# EAGLE design Klon (EAGLE 9.2.2)
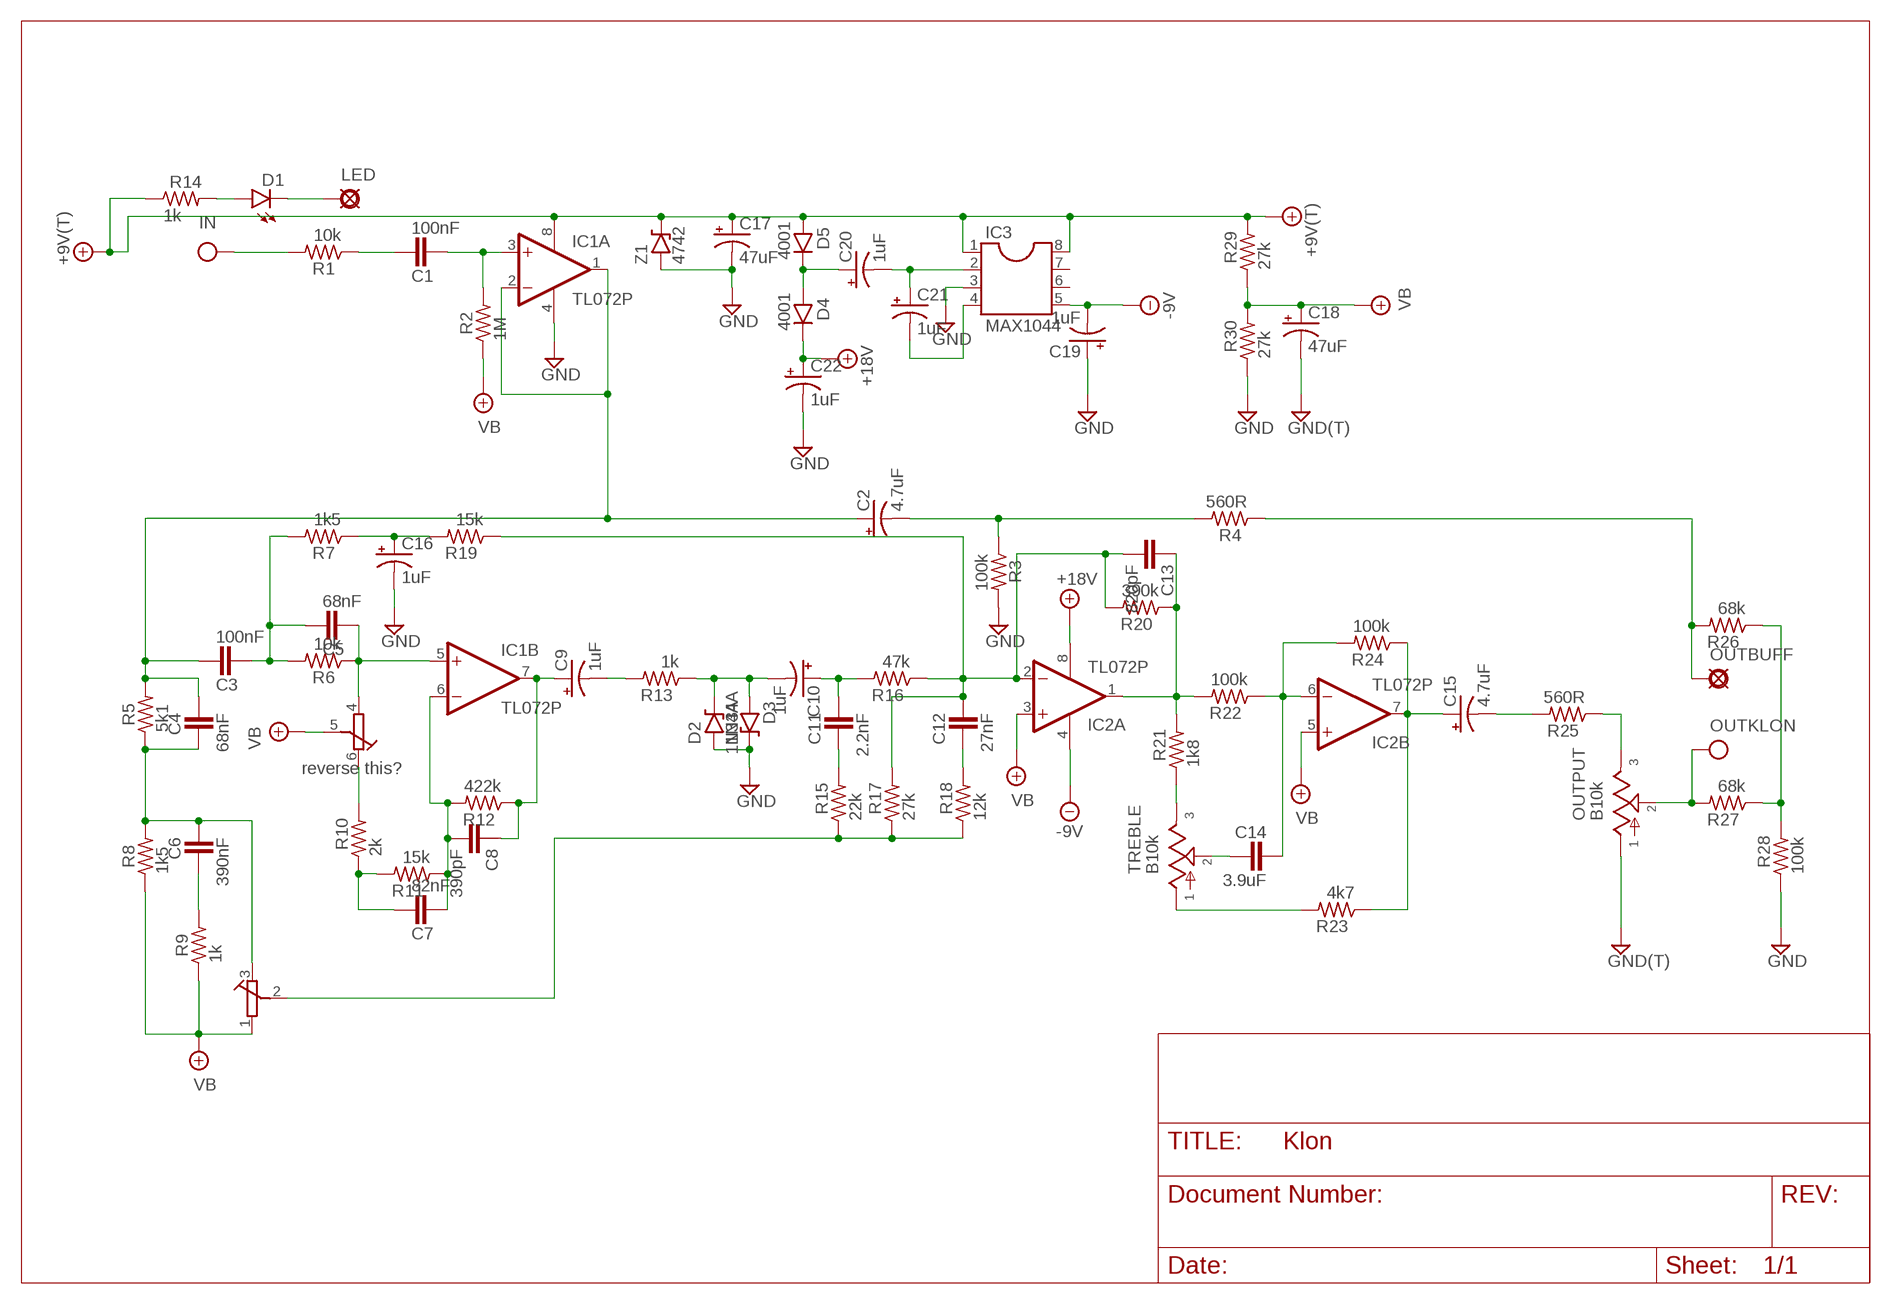
[diagram p0: schematic, sheet 1]

## Parts
+9V  +9V(T)  [SQUARE]
+9V1  +9V(T)  [SQUARE]
C1  100nF  072X0252  [072X025]
C2  4.7uF  0501  [050_020_1]
C3  100nF  072X0252  [072X025]
C4  68nF  072X0252  [072X025]
C5  68nF  072X0252  [072X025]
C6  390nF  072X0252  [072X025]
C7  82nF  072X0252  [072X025]
C8  390pF  050X030_0251  [050X030_025]
C9  1uF  0501  [050_020_1]
C10  1uF  0501  [050_020_1]
C11  2.2nF  072X0252  [072X025]
C12  27nF  072X0252  [072X025]
C13  820pF  050X030_0251  [050X030_025]
C14  3.9uF  072X0252  [072X025]
C15  4.7uF  0501  [050_020_1]
C16  1uF  0501  [050_020_1]
C17  47uF  0631  [063_025]
C18  47uF  0631  [063_025]
C19  1uF  0501  [050_020_1]
C20  1uF  0501  [050_020_1]
C21  1uF  0501  [050_020_1]
C22  1uF  0501  [050_020_1]
D1  LED  LED3MM  [LED3MM]
D2  1N34A  1N9ZENER  [DO35-3]
D3  1N34A  1N9ZENER  [DO35-3]
D4  4001  1N400X.3  [DO41-3]
D5  4001  1N400X.3  [DO41-3]
G  GND(T)  [SQUARE]
G1  GND(T)  [SQUARE]
GAIN  B100k  ALPHA16MM  [ALPHA16MM]
IC1  TL072P  [DIL08]
IC2  TL072P  [DIL08]
IC3  MAX1044  [DIL08]
IN  IN(T)  [SQUARE]
LED  PAD  [SQUARE]
OUTBUFF  PAD  [SQUARE]
OUTKLON  OUT(T)  [SQUARE]
OUTPUT  B10k  POT16MM  [16MM]
R1  10k  6MM.3  [R0207/3]
R2  1M  6MM.3  [R0207/3]
R3  100k  6MM.3  [R0207/3]
R4  560R  6MM.3  [R0207/3]
R5  5k1  6MM.3  [R0207/3]
R6  10k  6MM.3  [R0207/3]
R7  1k5  6MM.3  [R0207/3]
R8  1k5  6MM.3  [R0207/3]
R9  1k  6MM.3  [R0207/3]
R10  2k  6MM.3  [R0207/3]
R11  15k  6MM.3  [R0207/3]
R12  422k  6MM.3  [R0207/3]
R13  1k  6MM.3  [R0207/3]
R14  1k  6MM.3  [R0207/3]
R15  22k  6MM.3  [R0207/3]
R16  47k  6MM.3  [R0207/3]
R17  27k  6MM.3  [R0207/3]
R18  12k  6MM.3  [R0207/3]
R19  15k  6MM.3  [R0207/3]
R20  390k  6MM.3  [R0207/3]
R21  1k8  6MM.3  [R0207/3]
R22  100k  6MM.3  [R0207/3]
R23  4k7  6MM.3  [R0207/3]
R24  100k  6MM.3  [R0207/3]
R25  560R  6MM.3  [R0207/3]
R26  68k  6MM.3  [R0207/3]
R27  68k  6MM.3  [R0207/3]
R28  100k  6MM.3  [R0207/3]
R29  27k  6MM.3  [R0207/3]
R30  27k  6MM.3  [R0207/3]
TREBLE  B10k  POT16MM  [16MM]
Z1  4742  1N47XX3  [DO41-3]

## Nets
+9V: +9V1.1(+9V) +9V.1(+9V) C17.+ D5.A IC1.8(P:V+) IC3.1 IC3.8 R14.1 R29.2 Z1.C
+18V: C22.+ D4.C IC2.8(P:V+)
-9V: C19.- IC2.4(P:V-) IC3.5
GND: C16.- C17.- C18.- C19.+ C22.- D2.A D3.C G1.1(GND) G.1(GND) IC1.4(P:V-) IC3.3 OUTPUT.1 R3.2 R28.1 R30.1 Z1.A
IN: IN.1(IN) R1.2
N$1: C2.- R3.1 R4.2
N$2: D1.K(C) LED.1(PAD)
N$3: D1.A R14.2
N$4: C20.+ D4.A D5.C
N$5: C2.+ C3.2 C4.2 IC1.1(A:OUT) IC1.2(A:-IN) R5.2
N$6: C21.- IC3.4
N$7: C13.1 IC2.1(A:OUT) R20.1 R21.2 R22.2
N$8: C6.1 R9.2
N$9: OUTBUFF.1(PAD) R4.1 R26.2
N$10: C1.2 R1.1
N$11: C1.1 IC1.3(A:+IN) R2.2
N$12: C4.1 C6.2 GAIN.3(IN) R5.1 R8.2
N$13: C9.- R13.2
N$14: C3.1 C5.2 R6.2 R7.2
N$15: C16.+ R7.1 R19.2
N$16: C5.1 GAIN.4(GND) IC1.5(B:+IN) R6.1
N$17: GAIN.6(IN) R10.2
N$18: C7.2 R10.1 R11.2
N$19: C7.1 C8.2 IC1.6(B:-IN) R11.1 R12.2
N$20: C8.1 C9.+ IC1.7(B:OUT) R12.1
N$21: C10.- D2.C D3.A R13.1
N$22: R21.1 TREBLE.3
N$23: C10.+ C11.2 R16.2
N$24: C11.1 R15.2
N$25: C12.2 C13.2 IC2.2(A:-IN) R16.1 R17.2 R19.1 R20.2
N$26: GAIN.2(OUT) R15.1 R17.1 R18.1
N$27: C12.1 R18.2
N$28: C14.1 TREBLE.2
N$29: C14.2 IC2.6(B:-IN) R22.1 R24.2
N$30: R23.2 TREBLE.1
N$31: C15.+ IC2.7(B:OUT) R23.1 R24.1
N$32: C15.- R25.2
N$33: OUTPUT.3 R25.1
N$34: C20.- C21.+ IC3.2
N$35: R26.1 R27.1 R28.2
OUT: OUTKLON.1(OUT) OUTPUT.2 R27.2
VB: C18.+ GAIN.1(GND) GAIN.5(OUT) IC2.3(A:+IN) IC2.5(B:+IN) R2.1 R8.1 R9.1 R29.1 R30.2
Unconnected: IC3.6 IC3.7

## Notes on the sheet
- reverse this?

## Library data of the parts
+9V +9V1 = mb_supply:+9V(T): +9V Voltage Supply use this to hook up +9v throughout a schematic instead of running wire automatically labels the net "+9v" adds a hookup pad to the circuit board
C1 C3-C7 C11 C12 C14 = mb_caps-box:072X025: 1000pF - 0.47uF WIMA MKP2 63, 100V: 1000pF - 0.015uF; MKS2 50V: 0.33 - 0.47uF; 63V: 1000pF - 0.22uF;
C2 C9 C10 C15 C16 C19-C22 = mb_caps-electro:050: 0.22 - 100uF Xicon values at Mouser.com: 10V: 10 - 100uF; 16V: 2.2 - 47uF; 25V: 0.47 - 47uF; 50V: 0.22 - 22uF
C8 C13 = mb_caps-ceramic:050X030_025: 47 - 120pF Xicon Ceramic Disc 2.5mm lead spacing
C17 C18 = mb_caps-electro:063: 33 - 220uF Xicon values at Mouser.com 10V: 220uF; 16V: 100uF; 25V: 100uF; 50V: 33uF
D1 = mb_diodes:LED
D2 D3 = mb_diodes:1N9*ZENER: 1N9???B Zener Diode DO-35 case 1N957B - 1N992B (6.8V to 200V)
D4 D5 = mb_diodes:1N400X: Rectifier Diodes often used in power supply to prevent damage from reverse polarization
G G1 = mb_supply:GND(T): Ground use this to hook up ground (GND) throughout a schematic instead of running wire automatically labels the net "GND" adds a hookup pad to the circuit board (you can use several)
GAIN = Pots - custom:ALPHA16MM
IC1 IC2 = mb_ics:TL072: OP AMP
IC3 = mb_ics:MAX1044
IN = mb_supply:IN(T): Input obsolete: use Pad instead and label net shematic input label with circuit board terminal/pad generally used only once on a schematic (because this device labels the net "IN" in the same way as a voltage supply or ground net)
LED OUTBUFF = mb_supply:PAD: PAD use this package for pads with any purpose, including input, output, send or return various pad shapes: round, square, octogonal, long, and long offset
OUTKLON = mb_supply:OUT(T): Output obsolete: use Pad instead and label net output label with circuit board terminal/pad usually appears only once on a schematic
OUTPUT TREBLE = mb_pots:POT: Potentiometers the arrow indicates the clockwise motion of th wiper (lug 2) fully counter clockwise there is no resistance between lugs 1 and 2 fully clockwise the resistance between lugs 1 and 2 is the value of the pot
R1-R30 = mb_resistors:6MM: 6mm Resistors Leads spaced 1-6 holes apart for 0.1" perfboard. Suitable for 1/4 watt resistors.
Z1 = mb_diodes:1N47XX: Zener Diode 1N4728 - 1N4764: 3.3 V - 100V, 10% (1n47xxA 5%); DO-41 glass case

## Board
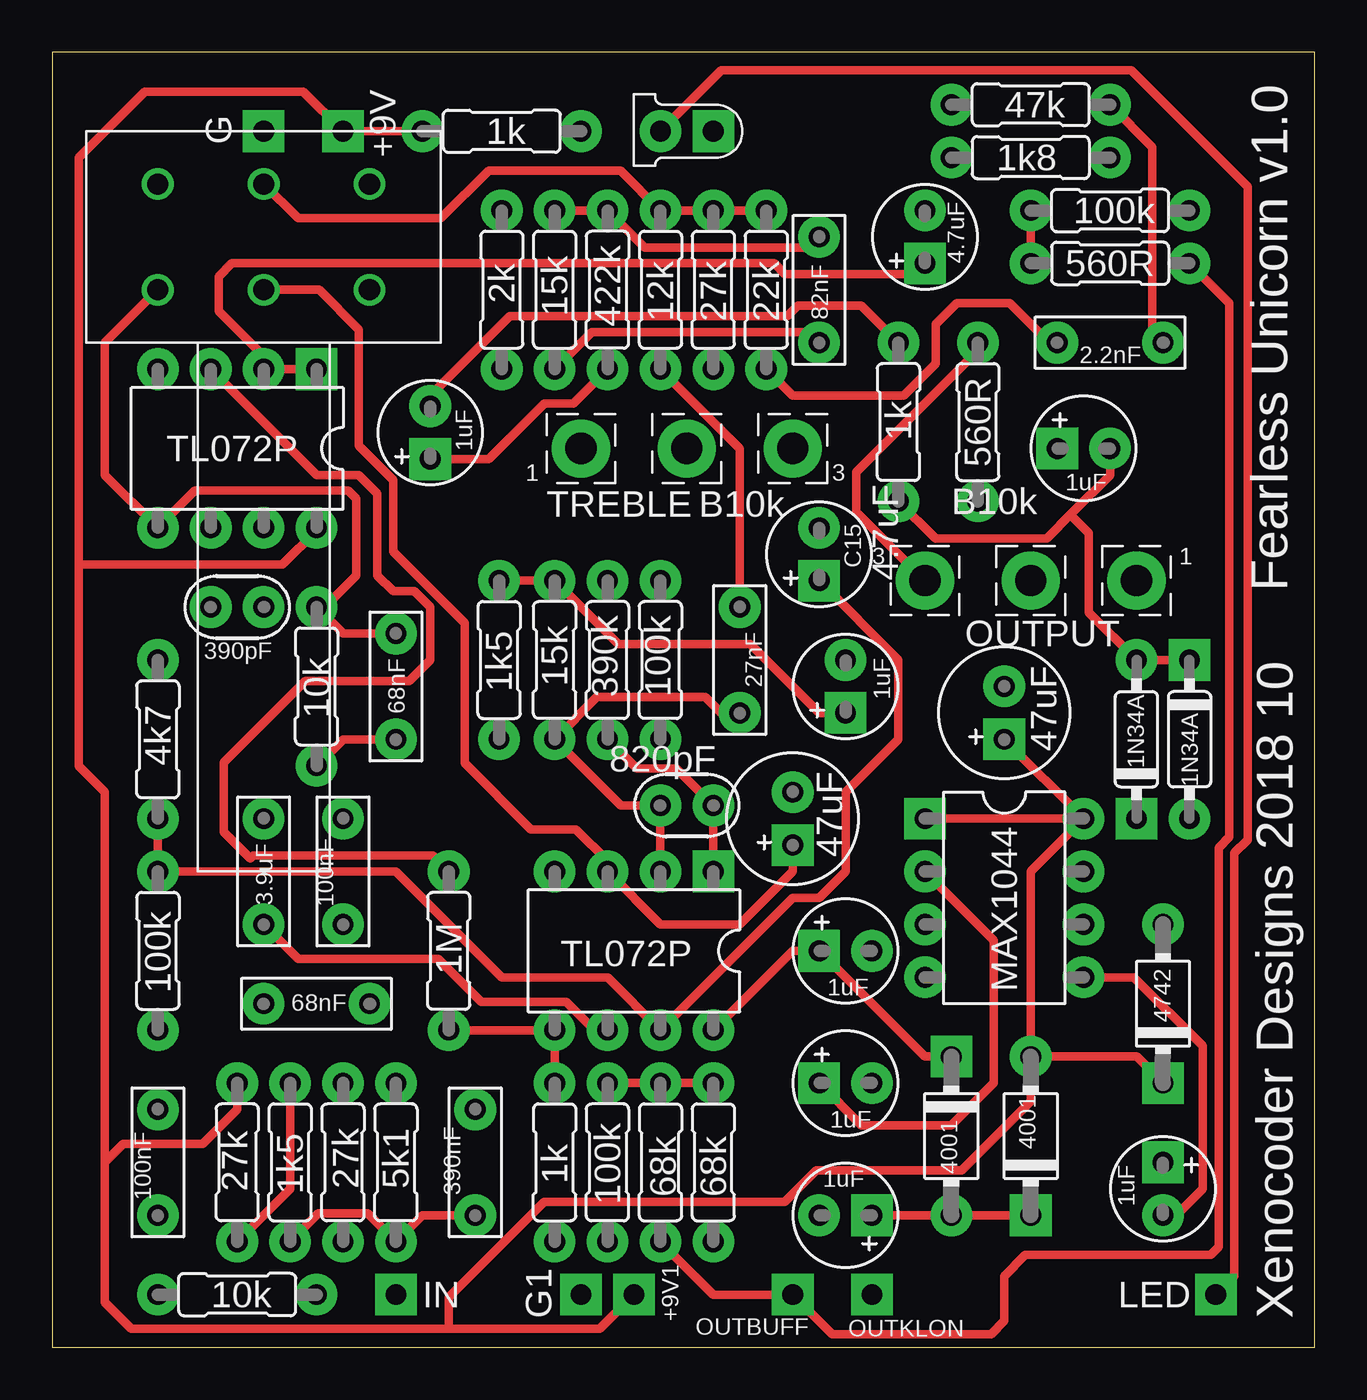
[diagram p1: board, top side]
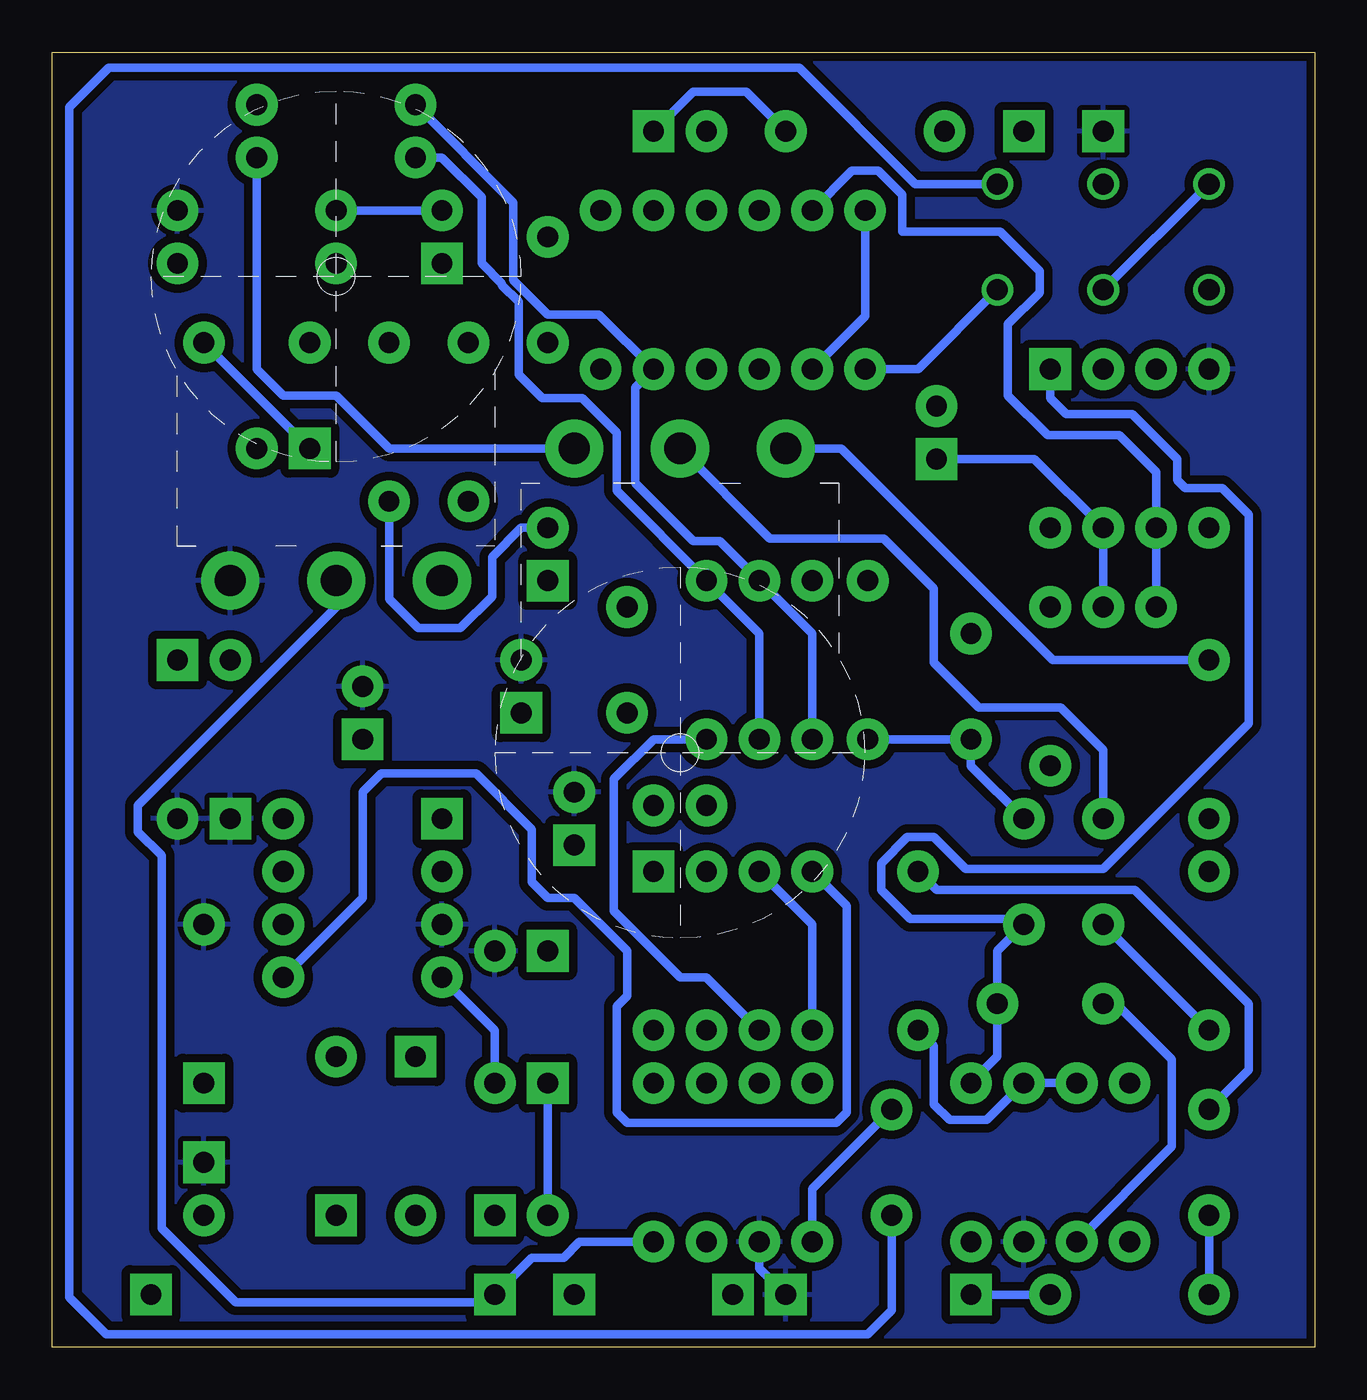
[diagram p2: board, bottom side, seen from below]

Size 60.63 x 62.22 mm. Coordinates in mm from the lower left corner, seen from the top.
Outline: 0,0 60.63,0 60.63,62.22 0,62.22 0,0
Copper layers (1*16): Top 0.035559375mm / dielectric 1.6mm / Bottom 0.035559375mm
Design rules "oshpark-2layer": minimum track width 6mil, minimum drill 10mil, track to track 6mil, track to pad 6mil, pad to pad 6mil, via to via 6mil, smd to smd 6mil, copper to edge 15mil, drill to drill 6mil, minimum pad ring 5mil, minimum via ring 5mil, stop-mask expansion 2.5mil, vias tented up to drill 0mil, thermal gap 10mil

### Footprints (pad centres in the part's own frame; a part is rotated, then mirrored left to right if it is on the bottom)
SQUARE = drill 1 pad 2 square: 1 0,0
072X025 = drill 1 pad 2: 1 -2.54,0; 2 2.54,0
050_020_1 = drill 1 pad 2 square: + -1.27,0 | drill 1 pad 2: - 1.27,0
050X030_025 = drill 1 pad 2: 1 -1.27,0; 2 1.27,0
063_025 = drill 1 pad 2 square: + -1.27,0 | drill 1 pad 2: - 1.27,0
LED3MM = drill 1 pad 2 square: A -1.27,0 | drill 1 pad 2: K 1.27,0
DO35-3 = drill 1 pad 2: A 3.81,0 | drill 1 pad 2 square: C -3.81,0
DO41-3 = drill 1 pad 2: A 3.81,0 | drill 1 pad 2 square: C -3.81,0
ALPHA16MM = drill 1.016: 1 -5.08,2.54; 2 0,2.54; 3 5.08,2.54; 4 -5.08,-2.54; 5 0,-2.54; 6 5.08,-2.54
DIL08 = drill 1 pad 2 square: 1 -3.81,-3.81 | drill 1 pad 2: 2 -1.27,-3.81; 3 1.27,-3.81; 4 3.81,-3.81; 5 3.81,3.81; 6 1.27,3.81; 7 -1.27,3.81; 8 -3.81,3.81
16MM = drill 1.5 pad 2.794: 1 5.08,0; 2 0,0; 3 -5.08,0
R0207/3 = drill 1 pad 2: 1 -3.81,0; 2 3.81,0

### Placement (x,y rotation side)
+9V  13.97,58.42 0 top
+9V1  27.94,2.54 0 top
C1  5.08,8.89 270 top
C2  41.91,53.34 90 top
C3  13.97,22.86 270 top
C4  12.7,16.51 0 top
C5  16.51,31.75 270 top
C6  20.32,8.89 270 top
C7  36.83,50.8 270 top
C8  8.89,35.56 180 top
C9  18.16,43.94 90 top
C10  49.53,43.18 0 top
C11  50.8,48.26 0 top
C12  33.02,33.02 270 top
C13  30.48,26.04 180 top
C14  10.16,22.86 270 top
C15  36.83,38.1 90 top
C16  38.1,31.75 90 top
C17  45.72,30.48 90 top
C18  35.56,25.4 90 top
C19  53.34,7.62 270 top
C20  38.1,6.35 180 top
C21  38.1,12.7 0 top
C22  38.1,19.05 0 top
D1  30.48,58.42 180 top
D2  54.61,29.21 270 top
D3  52.07,29.21 90 top
D4  43.18,10.16 270 top
D5  46.99,10.16 90 top
G  10.16,58.42 0 top
G1  25.4,2.54 0 top
GAIN  10.16,53.34 0 top
IC1  8.89,43.18 180 top
IC2  27.94,19.05 180 top
IC3  45.72,21.59 270 top
IN  16.51,2.54 0 top
LED  55.88,2.54 0 top
OUTBUFF  35.56,2.54 0 top
OUTKLON  39.37,2.54 0 top
OUTPUT  46.99,36.83 0 top
R1  8.89,2.54 0 top
R2  19.05,19.05 90 top
R3  50.8,54.61 0 top
R4  50.8,52.07 180 top
R5  16.51,8.89 90 top
R6  12.7,31.75 270 top
R7  21.46,33.02 270 top
R8  11.43,8.89 270 top
R9  24.13,8.89 270 top
R10  21.59,50.8 270 top
R11  24.13,50.8 270 top
R12  26.67,50.8 90 top
R13  40.64,44.45 90 top
R14  21.59,58.42 0 top
R15  34.29,50.8 270 top
R16  46.99,59.69 0 top
R17  31.75,50.8 270 top
R18  29.21,50.8 270 top
R19  24.13,33.02 90 top
R20  26.67,33.02 90 top
R21  46.99,57.15 180 top
R22  29.21,33.02 90 top
R23  5.08,29.21 90 top
R24  5.08,19.05 270 top
R25  44.45,44.45 270 top
R26  29.21,8.89 270 top
R27  31.75,8.89 270 top
R28  26.67,8.89 90 top
R29  8.89,8.89 90 top
R30  13.97,8.89 90 top
TREBLE  30.48,43.18 180 top
Z1  53.34,16.51 90 top

### Tracks (layer width: path | path; a pad name or v marks a point on that pad's centre or on a via)
+9V
  Top 0.406: R29.2 8.89,11.43 7.24,9.78 3.43,9.78 2.54,8.89 | 2.54,8.89 2.54,2.16 3.81,0.89 19.05,0.89 | 19.05,0.89 26.29,0.89 +9V1.1 | 2.54,8.89 2.54,26.67 1.27,27.94 1.27,37.47 | Z1.C 52.07,13.97 D5.A | IC3.8 IC3.1 | IC3.8 C17.+ | IC3.8 46.99,22.86 D5.A | R14.1 +9V.1 12.06,60.33 4.45,60.33 1.27,57.15 1.27,37.47 | IC1.8 12.7,39.24 11.05,37.59 1.4,37.59 1.27,37.47 | 19.05,0.89 19.05,2.41 23.62,6.99 35.18,6.99 36.7,8.51 43.69,8.51 46.99,11.81 D5.A
+18V
  Top 0.406: IC2.8 35.56,19.05 C22.+ 41.91,13.97 D4.C
-9V
  Top 0.406: C19.- 53.98,6.35 55.24,7.62 55.24,14.48 51.94,17.78 IC3.5
  Bottom 0.406: IC3.5 45.72,21.59 45.72,26.67 44.83,27.56 40.26,27.56 37.59,24.89 37.59,22.35 36.83,21.59 35.56,21.59 33.02,19.05 33.02,16.89 33.53,16.38 33.53,11.3 33.02,10.79 22.99,10.79 22.48,11.3 22.48,21.21 IC2.4
GND
  Bottom 0.406: G1.1 26.67,3.81 R28.1
  pour Bottom (isolate 0.406): 0,0 60.96,0 60.96,62.23 0,62.23
IN
  Bottom 0.406: IN.1 R1.2
N$1
  Top 0.406: R4.2 R3.1
  Bottom 0.406: C2.- R3.1
N$2
  Top 0.406: LED.1 56.77,3.43 56.77,23.75 57.4,24.38 57.4,55.75 51.82,61.34 32.13,61.34 D1.K
N$3
  Bottom 0.406: R14.2 27.3,60.33 29.84,60.33 D1.A
N$4
  Top 0.406: D5.C D4.A C20.+
N$5
  Top 0.406: C2.+ 41.4,51.56 35.18,51.56 34.67,52.07 8.64,52.07 8,51.44 8,49.78 10.16,47.62 IC1.2 IC1.1
  Bottom 0.406: R5.2 15.24,13.97 C4.2 15.24,19.05 C3.2 14.22,20.57 19.43,20.57 20.83,21.97 20.83,23.24 19.56,24.51 18.29,24.51 16.76,22.99 10.16,22.99 3.17,29.97 3.17,40.01 4.45,41.27 6.22,41.27 6.6,41.66 6.6,42.67 8.76,44.83 11.94,44.83 12.7,45.59 IC1.1
N$6
  Bottom 0.406: C21.- 39.37,15.24 IC3.4
N$7
  Top 0.406: IC2.1 C13.1 29.97,27.81 28.07,27.81 R20.1
  Bottom 0.406: R20.1 26.67,34.29 R22.2 33.53,41.15 33.53,43.94 35.18,45.59 37.08,45.59 38.23,46.74 38.23,50.22 39.04,51.03 39.04,51.1 40.01,52.07 40.01,55.24 41.91,57.15 R21.2
N$8
  Bottom 0.406: R9.2 24.13,7.62 C6.1
N$9
  Top 0.406: R26.2 31.75,2.54 OUTBUFF.1 37.47,0.64 45.09,0.64 45.72,1.27 45.72,3.43 46.74,4.45 55.63,4.45 56.01,4.83 56.01,24 56.52,24.51 56.52,50.16 R4.1
N$10
  Bottom 0.406: R1.1 C1.2
N$11
  Top 0.406: IC1.3 12.7,41.91 14.73,41.91 15.62,41.02 15.62,37.08 16.38,36.32 17.4,36.32 18.16,35.56 18.16,33.02 17.14,32 12.16,32 8.26,28.09 8.26,24.77 9.53,23.5 9.65,23.62 18.29,23.62 R2.2
  Bottom 0.406: C1.1 3.17,13.34 3.17,16.51 8.64,21.97 18.16,21.97 R2.2
N$12
  Top 0.406: C6.2 17.78,6.35 R5.1 15.15,6.44 12.79,6.44 R8.2
  Bottom 0.406: C4.1 9.53,16.51 6.86,13.84 6.86,9.65 R8.2 | C6.2 20.32,1.78 21.46,0.64 58.04,0.64 59.82,2.41 59.82,59.56 57.91,61.47 24.77,61.47 19.18,55.88 GAIN.3
N$13
  Top 0.406: C9.- 18.16,45.72 21.97,49.53 35.31,49.53 35.81,50.04 38.86,50.04 R13.2
N$14
  Top 0.406: R6.2 13.97,29.21 C5.2
  Bottom 0.406: C3.1 16.51,27.94 C5.2 R7.2
N$15
  Top 0.406: R7.1 R19.2 27.18,33.78 33.53,33.78 36.83,30.48 C16.+
N$16
  Top 0.406: C5.1 13.97,34.29 12.89,35.37 | 12.89,35.37 R6.1 | 12.89,35.37 14.61,37.08 14.61,40.77 14.22,41.15 6.86,41.15 IC1.5 2.54,41.91 2.54,48.26 GAIN.4
N$17
  Bottom 0.406: R10.2 19.05,46.99 GAIN.6
N$18
  Top 0.406: R11.2 25.91,48.77 36.32,48.77 C7.2
  Bottom 0.406: R11.2 21.59,49.53 R10.1
N$19
  Top 0.406: C7.1 36.32,52.83 28.45,52.83 R12.2 R11.1
  Bottom 0.406: R11.1 22.23,56.52 20.95,56.52 19.81,55.37 19.81,53.59 15.11,53.59 13.21,51.69 13.21,50.67 14.73,49.15 14.73,45.72 12.83,43.81 9.4,43.81 7.62,42.04 IC1.6 C8.2
N$20
  Top 0.406: C9.+ 20.95,42.67 23.62,45.34 25.02,45.34 R12.1
  Bottom 0.406: C8.1 IC1.7 13.46,42.67 C9.+
N$21
  Top 0.406: R13.1 42.42,38.86 47.75,38.86 48.96,40.07 | 48.96,40.07 50.8,41.91 C10.- | D2.C D3.A 49.78,35.31 49.78,39.12 48.96,39.94 48.96,40.07
N$22
  Bottom 0.406: TREBLE.3 44.45,43.18 46.99,45.72 49.53,45.72 50.8,46.99 R21.1
N$23
  Top 0.406: C11.2 52.83,48.77 52.83,57.66 R16.2
  Bottom 0.406: C10.+ C11.2
N$24
  Top 0.406: C11.1 47.88,48.26 45.97,50.16 43.43,50.16 42.42,49.15 42.42,47.24 40.89,45.72 35.56,45.72 R15.2
N$25
  Top 0.406: IC2.2 C13.2 27.3,26.04 R19.1 26.16,31.24 31.37,31.24 32.13,30.48 C12.2
  Bottom 0.406: R19.1 24.13,34.29 R20.2 28.57,38.73 29.84,38.73 32.64,41.53 32.64,46.1 R17.2 34.38,49.62 36.83,49.62 38.48,51.27 38.48,54.99 R16.1
N$26
  Top 0.406: R15.1 R17.1 R18.1 27.3,56.52 20.95,56.52 18.67,54.23 11.81,54.23 GAIN.2
N$27
  Top 0.406: C12.1 33.02,43.18 R18.2
N$28
  Bottom 0.406: C14.1 10.16,28.7 12.19,30.73 16.13,30.73 18.29,32.89 18.29,36.45 20.7,38.86 26.16,38.86 TREBLE.2
N$29
  Top 0.406: IC2.6 26.05,15.24 24.69,16.6 20.61,16.6 18.54,18.67 11.81,18.67 C14.2
  Bottom 0.406: R24.2 C14.2 | R22.1 31.75,29.21 33.66,27.3 33.66,20.95 30.48,17.78 29.21,17.78 IC2.6
N$30
  Bottom 0.406: R23.2 12.57,33.02 22.73,43.18 TREBLE.1
N$31
  Top 0.406: C15.+ 40.64,33.02 40.64,29.21 38.1,26.67 38.1,22.86 36.83,21.59 35.56,21.59 IC2.7 26.67,17.78 21.59,17.78 16.51,22.86 R24.1 R23.1
N$32
  Bottom 0.406: C15.- 38.1,39.37 39.5,37.97 39.5,36.07 41.02,34.54 43.05,34.54 44.45,35.94 R25.2
N$33
  Top 0.406: OUTPUT.3 38.61,40.13 38.61,42.04 44.45,47.88 R25.1
N$34
  Top 0.406: C21.+ 38.86,10.67 43.18,10.67 45.21,12.7 45.21,19.56 IC3.2
  Bottom 0.406: C20.- C21.+
N$35
  Top 0.406: R28.2 R26.1 R27.1
OUT
  Bottom 0.406: OUTPUT.2 46.99,35.56 56.52,26.04 56.52,24.77 55.37,23.62 55.37,5.71 51.82,2.16 39.75,2.16 OUTKLON.1 37.59,4.32 36.07,4.32 35.31,5.08 R27.2
VB
  Top 0.406: R29.1 11.43,7.62 R8.1 | R9.1 IC2.5 R2.1 | C18.+ 35.56,22.86 33.02,20.32 29.21,20.32 IC2.3 26.67,23.37 25.15,24.89 22.99,24.89 19.81,28.07 19.81,34.8 16.38,38.23 16.38,41.66 14.73,43.31 14.73,48.9 12.83,50.8 GAIN.5
  Bottom 0.406: IC2.5 24.13,20.32 IC2.3 | R8.1 R30.2 15.75,10.92 17.53,10.92 18.29,11.68 18.29,14.48 R2.1 | GAIN.1 GAIN.5

### Text on the board
tNames: Fearless Unicorn v1.0 | Xenocoder Designs 2018 10